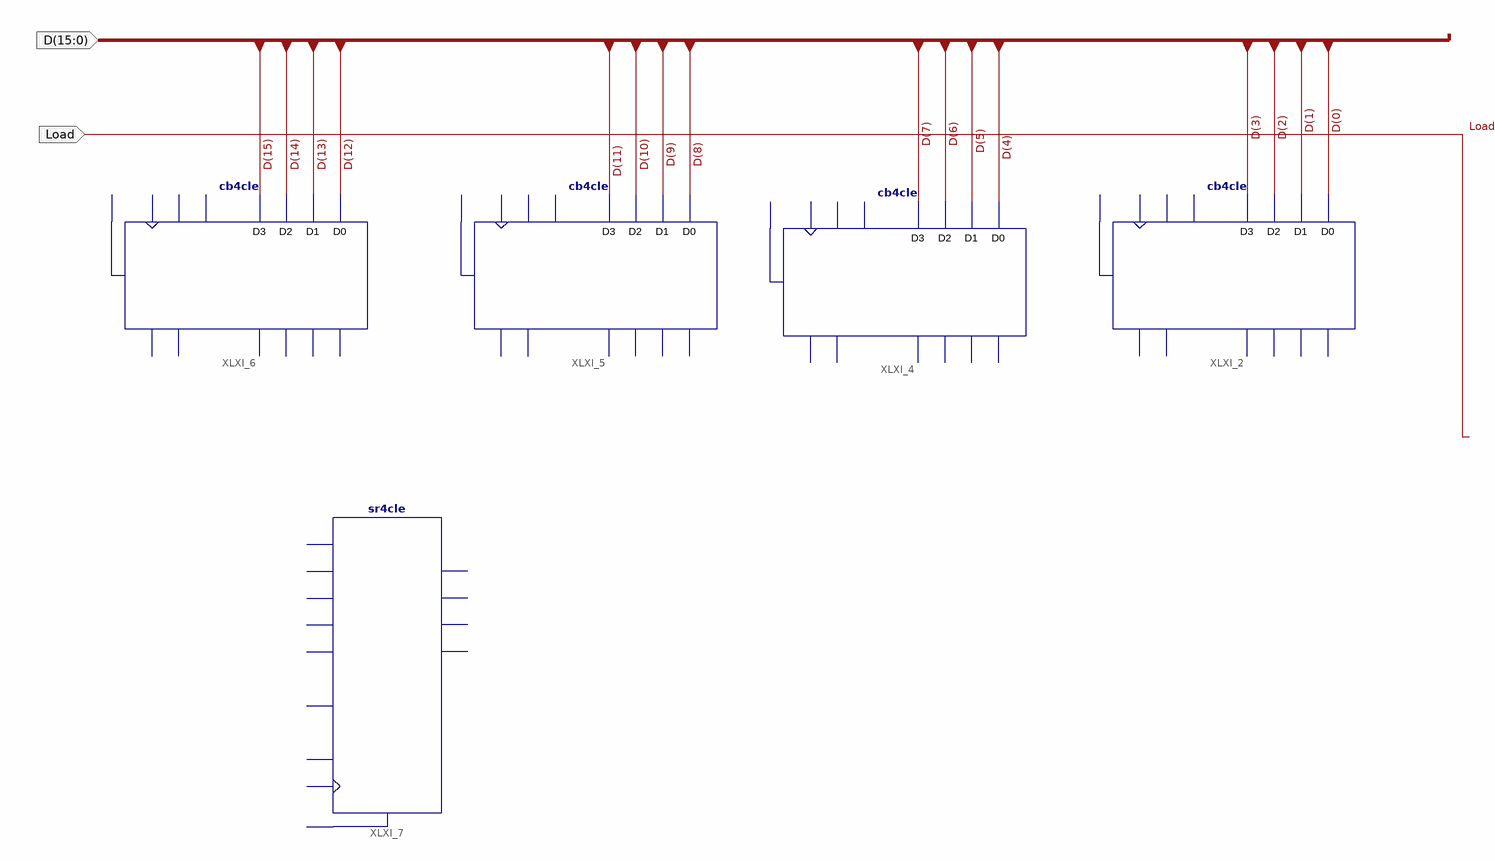
[diagram p0: schematic sheet 1]
// Xilinx ISE schematic hw1_5.sch (artix7) as structural Verilog: 5 symbols, 2 ports
module hw1_5 (
  input  [15:0] D,
  input  Load
);

  cb4cle XLXI_2 (.D0(D[0]), .D1(D[1]), .D2(D[2]), .D3(D[3]));  // open: C, CE, CLR, L, CEO, Q0, Q1, Q2, Q3, TC
  cb4cle XLXI_4 (.D0(D[4]), .D1(D[5]), .D2(D[6]), .D3(D[7]));  // open: C, CE, CLR, L, CEO, Q0, Q1, Q2, Q3, TC
  cb4cle XLXI_5 (.D0(D[8]), .D1(D[9]), .D2(D[10]), .D3(D[11]));  // open: C, CE, CLR, L, CEO, Q0, Q1, Q2, Q3, TC
  cb4cle XLXI_6 (.D0(D[12]), .D1(D[13]), .D2(D[14]), .D3(D[15]));  // open: C, CE, CLR, L, CEO, Q0, Q1, Q2, Q3, TC
  sr4cle XLXI_7 ();  // open: C, CE, CLR, D0, D1, D2, D3, L, SLI, Q0, Q1, Q2, Q3
endmodule
